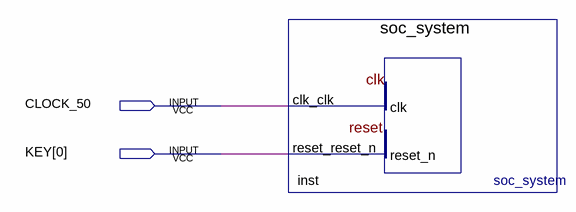
[diagram p0: schematic sheet]
// Quartus schematic TopLevel.bdf as structural Verilog: 1 symbols, 2 pins
module TopLevel (
  input  CLOCK_50,
  input  [0:0] KEY
);

  soc_system inst (.clk_clk(CLOCK_50), .reset_reset_n(KEY[0]));
endmodule
